# Altium project stesc.PrjPcb
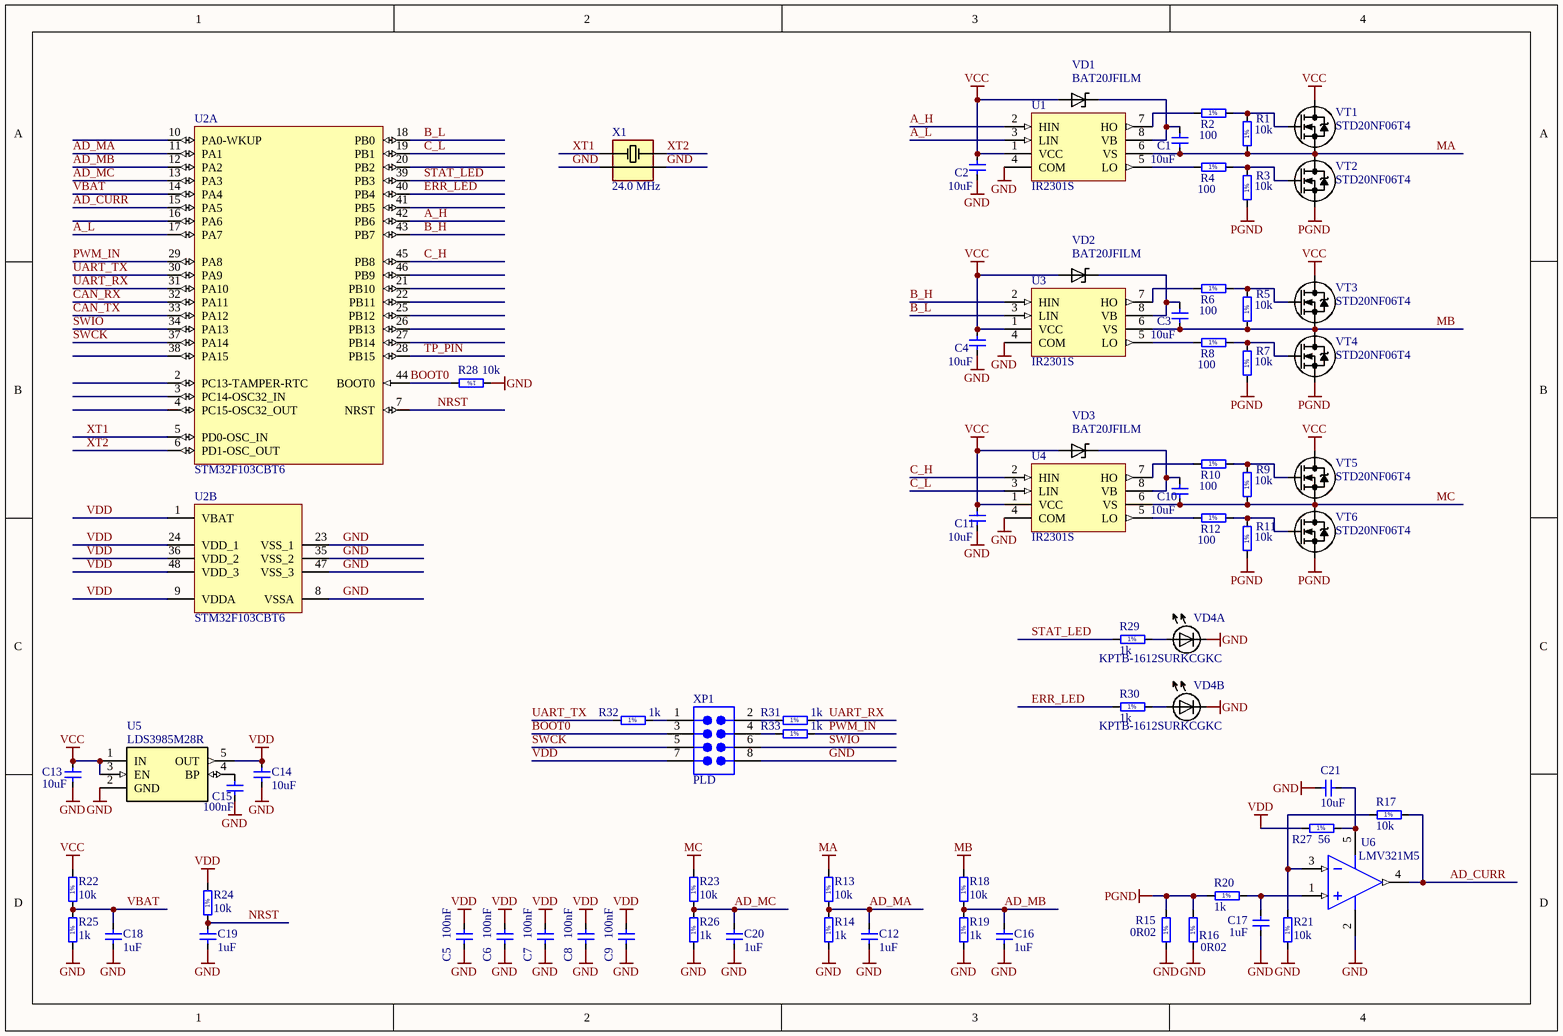
[diagram p0: stesc.SchDoc]
1 sheet, 73 parts. Net scope: global (net labels, ports and power ports of the same name join across sheets).
Board file: stesc.PcbDoc

## Sheet stesc.SchDoc
size A4

### Parts
(Parts that share a designator on the sheet are numbered #1, #2 ... from top to bottom, then left to right.)
C1  10uF  [CAP0805R]
C2  10uF  [CAP0805R]
C3  10uF  [CAP0805R]
C4  10uF  [CAP0805R]
C5  100nF  [CAP0402R]
C6  100nF  [CAP0402R]
C7  100nF  [CAP0402R]
C8  100nF  [CAP0402R]
C9  100nF  [CAP0402R]
C10  10uF  [CAP0805R]
C11  10uF  [CAP0805R]
C12  1uF  [CAP0402R]
C13  10uF  [CAP0603R]
C14  10uF  [CAP0603R]
C15  100nF  [CAP0402R]
C16  1uF  [CAP0402R]
C17  1uF  [CAP0402R]
C18  1uF  [CAP0402R]
C19  1uF  [CAP0402R]
C20  1uF  [CAP0402R]
C21  10uF  [CAP0603R]
R1  10k  [RES0402R]
R2  100  [RES0402R]
R3  10k  [RES0402R]
R4  100  [RES0402R]
R5  10k  [RES0402R]
R6  100  [RES0402R]
R7  10k  [RES0402R]
R8  100  [RES0402R]
R9  10k  [RES0402R]
R10  100  [RES0402R]
R11  10k  [RES0402R]
R12  100  [RES0402R]
R13  10k  [RES0402R]
R14  1k  [RES0402R]
R15  0R02  [RES2010R]
R16  0R02  [RES2010R]
R17  10k  [RES0402R]
R18  10k  [RES0402R]
R19  1k  [RES0402R]
R20  1k  [RES0402R]
R21  10k  [RES0402R]
R22  10k  [RES0402R]
R23  10k  [RES0402R]
R24  10k  [RES0402R]
R25  1k  [RES0402R]
R26  1k  [RES0402R]
R27  56  [RES0603R]
R28  10k  [RES0402R]
R29  1k  [RES0402R]
R30  1k  [RES0402R]
R31  1k  [RES0402R]
R32  1k  [RES0402R]
R33  1k  [RES0402R]
U1  IR2301S  [SO-8_N]
U2#1  STM32F103CBT6  [STM-LQFP48_L]  (part A of 2)
U2#2  STM32F103CBT6  [STM-LQFP48_L]  (part B of 2)
U3  IR2301S  [SO-8_N]
U4  IR2301S  [SO-8_N]
U5  LDS3985M28R  [SOT23H15-5]
U6  LMV321M5  [DBV0005A_L]
VD1  BAT20JFILM  [SOD323]
VD2  BAT20JFILM  [SOD323]
VD3  BAT20JFILM  [SOD323]
VD4  KPTB-1612SURKCGKC  [LED1612]  (parts A,B of 2)
VT1  STD20NF06T4  [DPAK]
VT2  STD20NF06T4  [DPAK]
VT3  STD20NF06T4  [DPAK]
VT4  STD20NF06T4  [DPAK]
VT5  STD20NF06T4  [DPAK]
VT6  STD20NF06T4  [DPAK]
X1  24.0 MHz  [3225]
XP1  PLD  [PLD-08]

### Nets
GND: C2.1 C4.1 C5.2 C6.2 C7.2 C8.2 C9.2 C11.1 C12.1 C13.1 C14.1 C15.2 C16.1 C17.1 C18.1 C19.1 C20.1 C21.1 R14.1 R15.1 R16.1 R19.1 R21.1 R25.1 R26.1 R28.1 U1.4(COM) U2#2.8(VSSA) U2#2.23(VSS_1) U2#2.35(VSS_2) U2#2.47(VSS_3) U3.4(COM) U4.4(COM) U5.2(GND) U6.2(V-) VD4.K1 VD4.K2 X1.2 X1.4 XP1.8
MA: C1.1 R1.1 R13.2 U1.6(VS) VT1.2(S) VT2.3(D)
MB: C3.1 R5.1 R18.2 U3.6(VS) VT3.2(S) VT4.3(D)
MC: C10.1 R9.1 R23.2 U4.6(VS) VT5.2(S) VT6.3(D)
PGND: R3.1 R7.1 R11.1 R15.2 R16.2 R20.1 VT2.2(S) VT4.2(S) VT6.2(S)
VCC: C2.2 C4.2 C11.2 C13.2 R22.2 U1.1(VCC) U3.1(VCC) U4.1(VCC) U5.1(IN) U5.3(EN) VD1.A VD2.A VD3.A VT1.3(D) VT3.3(D) VT5.3(D)
VDD: C5.1 C6.1 C7.1 C8.1 C9.1 C14.2 R24.2 R27.1 U2#2.1(VBAT) U2#2.9(VDDA) U2#2.24(VDD_1) U2#2.36(VDD_2) U2#2.48(VDD_3) U5.5(OUT) XP1.7
A_H: U1.2(HIN) U2#1.42(PB6)
A_L: U1.3(LIN) U2#1.17(PA7)
AD_CURR: R17.2 U2#1.15(PA5) U6.4(OUT)
AD_MA: C12.2 R13.1 R14.2 U2#1.11(PA1)
AD_MB: C16.2 R18.1 R19.2 U2#1.12(PA2)
AD_MC: C20.2 R23.1 R26.2 U2#1.13(PA3)
B_H: U2#1.43(PB7) U3.2(HIN)
B_L: U2#1.18(PB0) U3.3(LIN)
BOOT0: R28.2 U2#1.44(BOOT0) XP1.3
C_H: U2#1.45(PB8) U4.2(HIN)
C_L: U2#1.19(PB1) U4.3(LIN)
CAN_RX: U2#1.32(PA11)
CAN_TX: U2#1.33(PA12)
ERR_LED: R30.1 U2#1.40(PB4)
NRST: C19.2 R24.1 U2#1.7(NRST)
PWM_IN: R33.2 U2#1.29(PA8)
STAT_LED: R29.1 U2#1.39(PB3)
SWCK: U2#1.37(PA14) XP1.5
SWIO: U2#1.34(PA13) XP1.6
TP_PIN: U2#1.28(PB15)
UART_RX: R31.2 U2#1.31(PA10)
UART_TX: R32.1 U2#1.30(PA9)
VBAT: C18.2 R22.1 R25.2 U2#1.14(PA4)
XT1: U2#1.5(PD0-OSC_IN) X1.1
XT2: U2#1.6(PD1-OSC_OUT) X1.3
NetC1_2: C1.2 U1.8(VB) VD1.K
NetC3_2: C3.2 U3.8(VB) VD2.K
NetC10_2: C10.2 U4.8(VB) VD3.K
NetC15_1: C15.1 U5.4(BP)
NetC17_2: C17.2 R20.2 U6.1(IN+)
NetC21_2: C21.2 R27.2 U6.5(V+)
NetR1_2: R1.2 R2.2 VT1.1(G)
NetR2_1: R2.1 U1.7(HO)
NetR3_2: R3.2 R4.2 VT2.1(G)
NetR4_1: R4.1 U1.5(LO)
NetR5_2: R5.2 R6.2 VT3.1(G)
NetR6_1: R6.1 U3.7(HO)
NetR7_2: R7.2 R8.2 VT4.1(G)
NetR8_1: R8.1 U3.5(LO)
NetR9_2: R9.2 R10.2 VT5.1(G)
NetR10_1: R10.1 U4.7(HO)
NetR11_2: R11.2 R12.2 VT6.1(G)
NetR12_1: R12.1 U4.5(LO)
NetR17_1: R17.1 R21.2 U6.3(IN-)
NetR29_2: R29.2 VD4.A1
NetR30_2: R30.2 VD4.A2
NetR31_1: R31.1 XP1.2
NetR32_2: R32.2 XP1.1
NetR33_1: R33.1 XP1.4

Not connected (* = marked no-connect by the designer): U2#1 2(PC13-TAMPER-RTC) 3(PC14-OSC32_IN) 4(PC15-OSC32_OUT) 10(PA0-WKUP) 16(PA6) 20(PB2) 21(PB10) 22(PB11) 25(PB12) 26(PB13) 27(PB14) 38(PA15) 41(PB5) 46(PB9)

### Notes on the sheet
- (in symbol R0402_1K_1%_0.0625W_100PPM) 1%
- (in symbol R0402_10K_1%_0.0625W_100PPM) 1%
- (in symbol R0402_100R_1%_0.1W_100PPM_50V) 1%
- (in symbol R0603_56R_1%_0.1W_100PPM) 1%
- (in symbol R2010_0R02_1%_1W_100PPM) 1%

### Library data of the parts
C1-C4 C10 C11 = CC0805_10UF_25V_10%_X5R: Part Description: SMD Multilayer Chip Ceramic Capacitor; Manufacturer: GENERIC; Manufacturer1 Part Number: C2012X5R1E106K125AB; Voltage: 25V; TC: X5R; Tolerance: ±10%; Table: Capacitors SMD; Part Number: CC0805_10UF_25V_10%_X5R; Component Kind: Standard; Component Type: Standard; Pin Count: 2; Value: 10uF; Status: Preferred; Manufacturer Part Number: CC0805_10UF_25V_10%_X5R; Case: 0805; Mounted: Yes; Socket: No; SMD: Yes; Manufacturer1 Example: TDK; Manufacturer1 ComponentHeight: 1.4mm; HelpURL: \\cern.ch\dfs\Applications\Altium\Datasheets\CC0805_X5R_TDK_C.pdf; Author: I. Kuznetsov; CreateDate: 10/25/2012; LatestRevisionDate: 10/25/2012; Manufacturer Part Number 2: CC0805KKX5R8BB106
C5-C9 C15 = CC0402_100NF_16V_10%_X5R: Part Description: SMD Multilayer Chip Ceramic Capacitor; Manufacturer: GENERIC; Manufacturer1 Part Number: GRM155R61C104KA88D; Voltage: 16V; TC: X5R; Tolerance: ±10%; Table: Capacitors SMD; Part Number: CC0402_100NF_16V_10%_X5R; Component Kind: Standard; Component Type: Standard; Pin Count: 2; Value: 100nF; Status: None; Manufacturer Part Number: CC0402_100NF_16V_10%_X5R; Case: 0402; Mounted: Yes; Socket: No; SMD: Yes; Manufacturer1 Example: MURATA; Manufacturer1 ComponentHeight: 0.55mm; HelpURL: \\cern.ch\dfs\Applications\Altium\Datasheets\CC0402_X5R_MURATA_GRM.pdf; Author: I. Kuznetsov; CreateDate: 10.12.2013; LatestRevisionDate: 10.12.2013; Manufacturer Part Number 2: CC0402KPX5R7BB104
C12 C16-C20 = CC0402_1UF_16V_10%_X5R: Part Description: SMD Multilayer Chip Ceramic Capacitor; Manufacturer: GENERIC; Manufacturer1 Part Number: C1005X5R1C105KT; Voltage: 16V; TC: X5R; Tolerance: ±10%; Table: Capacitors SMD; Part Number: CC0402_1UF_16V_10%_X5R; Component Kind: Standard; Component Type: Standard; Pin Count: 2; Value: 1uF; Status: Preferred; Manufacturer Part Number: CC0402_1UF_16V_10%_X5R; Case: 0402; Mounted: Yes; Socket: No; SMD: Yes; Manufacturer1 Example: TDK; Manufacturer1 ComponentHeight: 0.55mm; HelpURL: \\cern.ch\dfs\Applications\Altium\Datasheets\CC0402_X5R_TDK_C.pdf; Author: I. Kuznetsov; CreateDate: 25.10.2012; LatestRevisionDate: 25.10.2012
C13 C14 C21 = CC0603_10UF_6.3V_20%_X5R: Part Description: SMD Multilayer Chip Ceramic Capacitor; Manufacturer: GENERIC; Manufacturer1 Part Number: C0603C106M9PAC; Voltage: 6.3V; TC: X5R; Tolerance: ±20%; Table: Capacitors SMD; Part Number: CC0603_10UF_6.3V_20%_X5R; Component Kind: Standard; Component Type: Standard; Pin Count: 2; Value: 10uF; Status: Preferred; Manufacturer Part Number: CC0603_10uF_6.3V_20%_X5R; Case: 0603; Mounted: Yes; Socket: No; SMD: Yes; Manufacturer1 Example: KEMET; Manufacturer1 ComponentHeight: 0.95mm; HelpURL: \\cern.ch\dfs\Applications\Altium\Datasheets\CC0603_X5R_KEMET.pdf; Author: I. Kuznetsov; CreateDate: 03.12.2007; LatestRevisionDate: 03.12.2007
R1 R3 R5 R7 R9 R11 R13 R17 R18 R21-R24 R28 = R0402_10K_1%_0.0625W_100PPM: Part Description: General Purpose Thick Film Chip Resistor; Manufacturer: GENERIC; Manufacturer1 Part Number: 232270671003L; TC: ±100ppm/°C; Tolerance: ±1%; Table: Resistors SMD; Part Number: R0402_10K_1%_0.0625W_100PPM; Component Kind: Standard; Component Type: Standard; Footprint: RESC1005X40N; Pin Count: 2; Value: 10k; Status: Not recommended; Power: 0.0625W; Manufacturer Part Number: R0402_10K_1%_0.0625W_100PPM; Case: 0402; Mounted: Yes; Socket: No; SMD: Yes; Manufacturer1 Example: YAGEO PHYCOMP; Manufacturer1 ComponentHeight: 0.4mm; HelpURL: \\cern.ch\dfs\Applications\Altium\Datasheets\R0402_Phycomp_RC0402.pdf; Author: CERN DEM JLC
  R1 R3 R5 R7 R9 R11: CreateDate: 12/3/2007; LatestRevisionDate: 10/17/2012
  R13 R17 R18 R21-R24 R28: CreateDate: 03.12.2007; LatestRevisionDate: 17.10.2012
R2 R4 R6 R8 R10 R12 = R0402_100R_1%_0.1W_100PPM_50V: Part Description: General Purpose Thick Film Chip Resistor; Manufacturer: GENERIC; Manufacturer1 Part Number: ERJ2RKF1000X; Power: 0.0625W; TC: ±100ppm/°C; Tolerance: ±1%; Voltage: 50V; Table: Resistors SMD; Part Number: R0402_100R_1%_0.1W_100PPM_50V; Component Kind: Standard; Component Type: Standard; Footprint: RESC1005X40N; Pin Count: 2; Value: 100; Status: Not recommended; Manufacturer Part Number: R0402_100R_1%_0.1W_100PPM_50V; Case: 0402; Mounted: Yes; Socket: No; SMD: Yes; Manufacturer1 Example: PANASONIC; Manufacturer1 ComponentHeight: 0.4mm; HelpURL: \\cern.ch\dfs\Applications\Altium\Datasheets\R0603_PANASONIC_ERJ2RK.pdf; Author: CERN DEM JLC; CreateDate: 12/12/2013; LatestRevisionDate: 12/12/2013
R14 R19 R20 R25 R26 R29-R33 = R0402_1K_1%_0.0625W_100PPM: Part Description: General Purpose Thick Film Chip Resistor; Manufacturer: GENERIC; Manufacturer1 Part Number: 232270671002L; TC: ±100ppm/°C; Tolerance: ±1%; Table: Resistors SMD; Part Number: R0402_1K_1%_0.0625W_100PPM; Component Kind: Standard; Component Type: Standard; Footprint: RESC1005X40N; Pin Count: 2; Value: 1k; Status: Not recommended; Power: 0.0625W; Manufacturer Part Number: R0402_1K_1%_0.0625W_100PPM; Case: 0402; Mounted: Yes; Socket: No; SMD: Yes; Manufacturer1 Example: YAGEO PHYCOMP; Manufacturer1 ComponentHeight: 0.4mm; HelpURL: \\cern.ch\dfs\Applications\Altium\Datasheets\R0402_Phycomp_RC0402.pdf; Author: CERN DEM JLC; CreateDate: 03.12.2007; LatestRevisionDate: 17.10.2012
R15 R16 = R2010_0R02_1%_1W_100PPM: Part Description: Low Value Flat Chip Resistor; Manufacturer: WELWYN COMPONENTS; Manufacturer Part Number: LRF2010-R02FW; Power: 1W; TC: ±100ppm/°C; Tolerance: ±1%; Part Number: R2010_0R02_1%_1W_100PPM; Component Kind: Standard; Component Type: Standard; Footprint: RESC5226X80N; Pin Count: 2; Value: 0R02; Status: Not recommended; Case: 2010; Mounted: Yes; Socket: No; SMD: Yes; ComponentHeight: 0.8mm; HelpURL: \\cern.ch\dfs\Applications\Altium\Datasheets\R1206_WELWYN_LRF.pdf; Author: CERN DEM JLC; CreateDate: 5/11/2010; LatestRevisionDate: 5/12/2010
R27 = R0603_56R_1%_0.1W_100PPM: Part Description: General Purpose Thick Film Chip Resistor; Manufacturer: GENERIC; Manufacturer1 Part Number: NRC06F56R0TRF; Power: 0.1W; TC: ±100ppm/°C; Tolerance: ±1%; Part Number: R0603_56R_1%_0.1W_100PPM; Component Kind: Standard; Component Type: Standard; Footprint: RESC1608X55N; Pin Count: 2; Value: 56; Status: Preferred; Manufacturer Part Number: R0603_56R_1%_0.1W_100PPM; Case: 0603; Mounted: Yes; Socket: No; SMD: Yes; Manufacturer1 Example: NIC COMPONENT; Manufacturer1 ComponentHeight: 0.55mm; HelpURL: \\cern.ch\dfs\Applications\Altium\Datasheets\R0603_NIC_NRC.pdf; Author: CERN DEM JLC; CreateDate: 12/3/2007; LatestRevisionDate: 3/13/2008
U1 U3 U4 = IR2101S: High and Low Side Driver; Published: 8-Jun-2000; LatestRevisionDate: 13-Apr-2006; LatestRevisionNote: IPC-7351 Footprint Added.; DatasheetVersion: PD60043J; PackageVersion: Feb-2001; PackageReference: SO-8; Publisher: Altium Limited; PackageDescription: 8-Pin Plastic Small Outline Integrated Circuit 1.27 mm Pitch; Code_JEDEC: MS-012-AA; Code_IPC: SOIC127P600-8; ComponentLink1Description: Manufacturer Link; ComponentLink1URL: http://www.irf.com/
U2#1 U2#2 = CMP-0237-00250-3: ARM Cortex-M3 32-bit MCU, 128 KB Flash, 20 KB Internal RAM, 37 I/Os, 48-pin LQFP, -40 to 85 degC, Tray; Supply Voltage(Vcc) min (V): 2; Operating Frequency(F) (Processor speed) (MHz): 72; A/D Converter: 2x12-bit (10 Channel); FLASH Size (Prog) (kB): 128; Internal RAM Size (kB): 20; I/Os (High Current): 37; ComponentLink2Description: Datasheet; PackageReference: LQFP48; PartNumber: STM32F103CBT6; ComponentLink1Description: Manufacturer URL; DatasheetVersion: Rev. 16; PackageVersion: Rev. 6, 06/2013; Packing: Tray; ComponentLink1URL: http://www.st.com/web/en/home.html; Mounting Technology: Surface Mount; ComponentLink3URL: http://www.st.com/st-web-ui/static/active/en/resource/technical/document/datasheet/DM00058181.pdf; PackageDescription: 48-Pin Low Profile Quad Flat Package, 7 x 7 mm Body, 0.5 mm Pitch; Core: ARM Cortex-M3; ComponentLink3Description: Package Specification; ComponentLink2URL: http://www.st.com/st-web-ui/static/active/en/resource/technical/document/datasheet/CD00161566.pdf
U5 = C014S0053T0000000090L0000000090: ManufName: ST Microelectronics; SubClassName: аналоговая; ValueBOM: Микросхема LDS3985M28R ST Microelectronics; ValueSch: LDS3985M28R; Design Item ID: C014S0053T0000000090L0000000090; Type: DA?; ClassName: Микросхема; PartNumber: LDS3985M28R; TypeName: LDS3985M28R; PackageName: SOT-23-5L
U6 = CMP-0055-01022-3: General Purpose, Low Voltage, Rail-to-Rail Output Operational Amplifiers, 5-pin SOT-23; Manufacturer: Texas Instruments; PowerWise: N; PackageTopMarking: A13*XTT; RoHS: N; CompType: Amplifiers; ComponentLink1URL: http://www.ti.com/general/docs/lit/getliterature.tsp?genericPartNumber=LMV321-N&fileType=pdf; PinCount: 5; PackageDescription: Molded SOT-23, .115 x .063 x .040 in Body, 5 Lead, .0375 in Pitch; Package Reference: DBV0005A; ComponentLink1Description: Datasheet URL
VD1-VD3 = C004S0020T0000000030L0000000030: ManufName: Kingbright; Type: VD?; SubClassName: Диод Шоттки; ValueBOM: Диод Шоттки BAT20JFILM Kingbright; Design Item ID: C004S0020T0000000030L0000000030; ValueSCH: BAT20JFILM; ClassName: Диод; PartNumber: BAT20JFILM; TypeName: BAT20JFILM; PackageName: SOD323
VD4 = C004S0020T0000000027L0000000027: ManufName: Kingbright; Type: VD?; SubClassName: Светодиод; ValueBOM: Светодиод KPTB-1612SURKCGKC Kingbright; Marking: *; Design Item ID: C004S0020T0000000027L0000000027; ValueSCH: KPTB-1612SURKCGKC; ClassName: Диод; PartNumber: KPTB-1612SURKCGKC; TypeName: KPTB-1612SURKCGKC; PackageName: LED1612
VT1-VT6 = STD20NF06T4: N-Channel Enhancement Mode FET; Part Description: N-CHANNEL 60V - 0.032 OHM - 24A DPAK STRIPFET II POWER MOSFET; Table: Transistors; Part Number: STD20NF06T4; Component Kind: Standard; Component Type: Standard; Device: STD20NF06T4; Status: Active; Case: DPAK; Mounted: Yes; Socket: No; SMD: Yes; Author: I. Kuznetsov
X1 = C012S0075T0000000004L0000000004: http://geyer-electronic.de/uploads/tx_userartikelfrequenz/GEYER-KX-7_01.pdf; PartNumber: KX-7; ManufName: GEYER; Value: 24M; SubClassName: Кварцевый резонатор; Design Item ID: C012S0075T0000000004L0000000004; Type: X?; ValueSCH: 24.0 MHz; ClassName: Пьезоэлектрические приборы; ValuePE: 24.0 MHz; ValueBOM: =SubClassName+' '+PartNumber+' ' +ValuePE+' '+V_Power_key+' '+ManufName
XP1 = PLD-08: Table: AUK; Part Number: PLD-08; Family: PLD; Device: PLD-08; ComponentLink1URL: http://lib.chipdip.ru/227/DOC000227157.pdf